# Altium project ECU V1.0 B.PrjPcb (part 12 of 17)
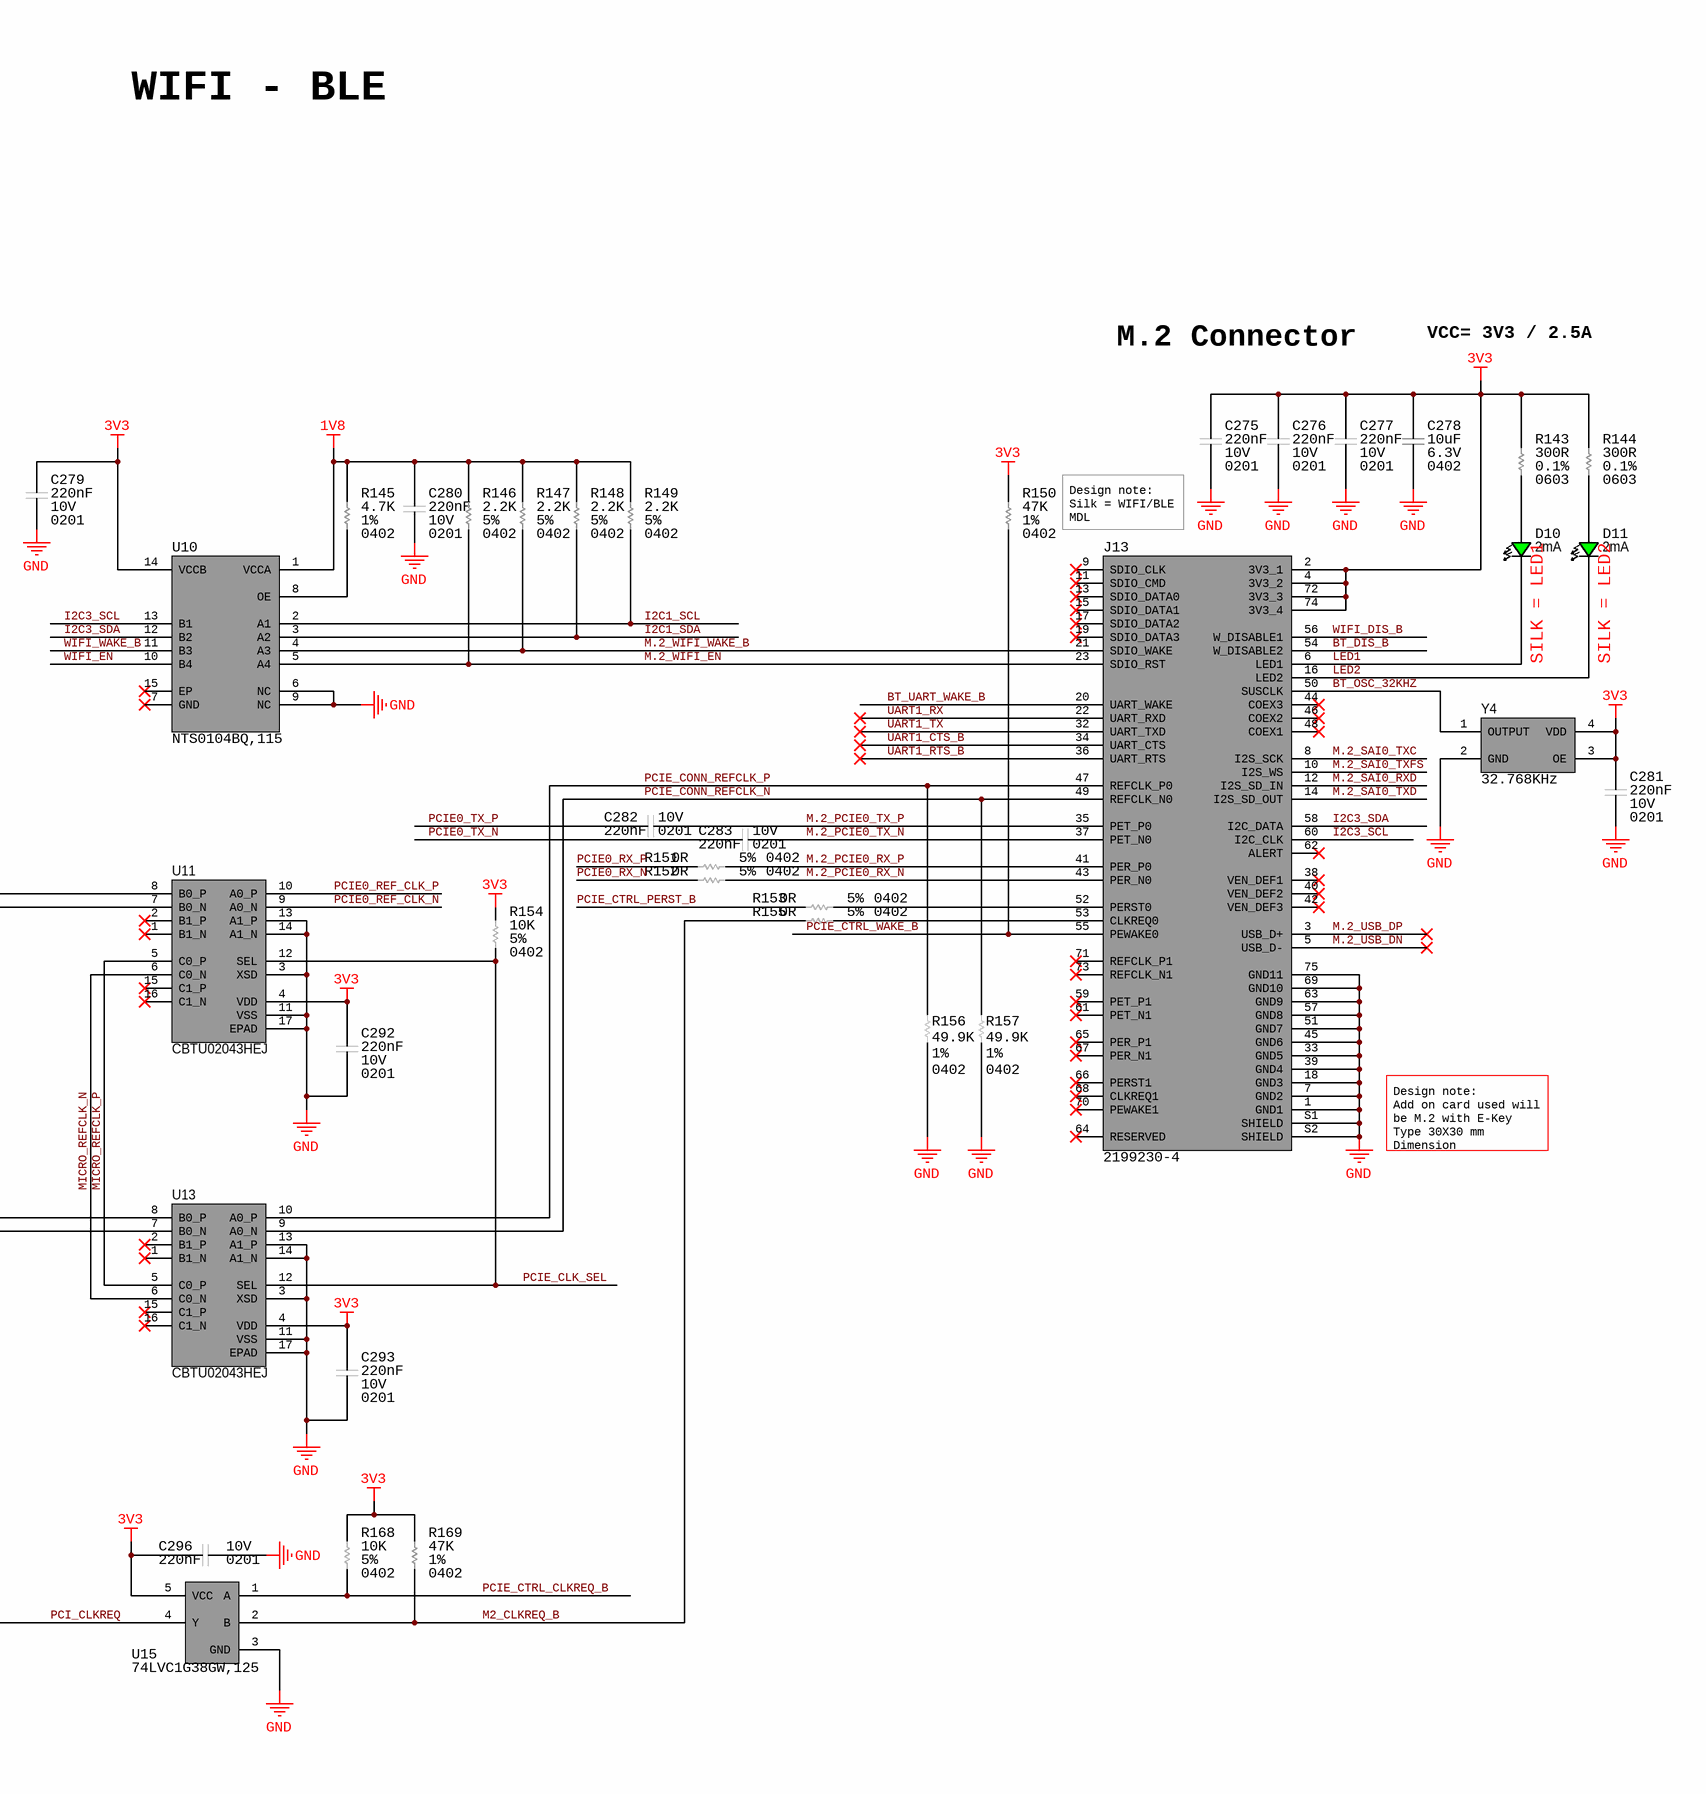
[diagram p20: 19_WIFI_BLE.SchDoc, right]

## Sheet 19_WIFI_BLE.SchDoc (continued)

### Library data of the parts
C275-C277 C279-C283 C292 C293 C296-C299 = CAP_0.22UF_10V_X5R_0201: as C201-C204 on sheet 16_LPDDR; Supplier 1: Digikey; Manufacturer Part Number: LMK063BJ224MP-F; RoHS: Yes; Category: Ceramic Capacitors; Stock 1: 6053224; Pricing 1: 1=0.12, 10=0.08, 50=0.0478, 100=0.0375, 500=0.02772, 1000=0.02295, 2500=0.02136, 5000=0.01954 (USD); Mount: Surface Mount; Case Code (Metric): 0603; Case Code (Imperial): 0201; Min Operating Temperature: -55°C; Max Operating Temperature: 85°C; Voltage Rating: 10V; Packaging: Tape and Reel; Package Quantity: 15000; Dielectric: X5R; Termination: SMD/SMT; Voltage: 10V; Series: M; Construction: Flat; Length: 0.6mm; Width: 0.3mm; Height: 0.3mm; Depth: 0.3mm; Radiation Hardening: No; Halogen Free: Halogen Free; RoHS Compliant: Yes; Reach SVHC Compliant: Unknown; ComponentLink1URL: https://datasheet.ciiva.com/134/lmk063bj224mp-f-ss-134995.pdf?src-supplier=Digikey; ComponentLink1Description: https://datasheet.ciiva.com/134/lmk063bj224mp-f-ss-134995.pdf?src-supplier=Digikey; ComponentLink2URL: https://datasheet.ciiva.com/11464/lmk063bj224mp-f-ss-11464053.pdf?src-supplier=Avnet; ComponentLink2Description: https://datasheet.ciiva.com/11464/lmk063bj224mp-f-ss-11464053.pdf?src-supplier=Avnet; ComponentLink3URL: https://datasheet.ciiva.com/15921/1589lmk063bj224mp-f-15921250.pdf?src-supplier=Onlinecomponents.com; ComponentLink3Description: https://datasheet.ciiva.com/15921/1589lmk063bj224mp-f-15921250.pdf?src-supplier=Onlinecomponents.com; ComponentLink4URL: https://datasheet.ciiva.com/26872/getdatasheetpartid-639019-26872592.pdf?src-supplier=Verical; ComponentLink4Description: https://datasheet.ciiva.com/26872/getdatasheetpartid-639019-26872592.pdf?src-supplier=Verical; ComponentLink5URL: https://datasheet.ciiva.com/30243/100lmk063bj224mp-f-30243150.pdf?src-supplier=Onlinecomponents.com; ComponentLink5Description: https://datasheet.ciiva.com/30243/100lmk063bj224mp-f-30243150.pdf?src-supplier=Onlinecomponents.com; ComponentLink6URL: https://datasheet.ciiva.com/28645/746258-28645141.pdf?src-supplier=Element14; ComponentLink6Description: https://datasheet.ciiva.com/28645/746258-28645141.pdf?src-supplier=Element14; ComponentLink7URL: https://datasheet.ciiva.com/5422/mlcc-all-e-541559-5422365.pdf?src-supplier=Mouser; ComponentLink7Description: https://datasheet.ciiva.com/5422/mlcc-all-e-541559-5422365.pdf?src-supplier=Mouser; Supplier Part Number 1: 587-2483-1-ND
C278 = CAP_10UF_6.3V_X5R_0402: Cap Ceramic 10uF 6.3V X5R 20% SMD 0402 85C T/R; Manufacturer: Samsung; Supplier 1: Digikey; Manufacturer Part Number: CL05A106MQ5NUNC; RoHS: Yes; Category: Ceramic Capacitors; Stock 1: 6097180; Pricing 1: 1=0.24, 10=0.153, 50=0.0968, 100=0.0774, 500=0.05588, 1000=0.04943, 2500=0.04728, 5000=0.04299 (USD); Mount: Surface Mount; Case Code (Metric): 1005; Case Code (Imperial): 0402; Min Operating Temperature: -55°C; Max Operating Temperature: 85°C; Packaging: Tape and Reel; Tolerance: 20%; Dielectric: X5R; Series: CL; Package Quantity: 1; Construction: Flat; Length: 1mm; Width: 0.02inch; Height: 0.5mm; Depth: 0.5mm; Thickness: 0.028inch; Radiation Hardening: No; RoHS Compliant: Yes; ComponentLink1URL: https://datasheet.ciiva.com/16437/cl05a106mq5nunc-16437356.pdf?src-supplier=Future+Electronics; ComponentLink1Description: https://datasheet.ciiva.com/16437/cl05a106mq5nunc-16437356.pdf?src-supplier=Future+Electronics; ComponentLink2URL: https://datasheet.ciiva.com/26877/getdatasheetpartid-355289-26877841.pdf?src-supplier=Verical; ComponentLink2Description: https://datasheet.ciiva.com/26877/getdatasheetpartid-355289-26877841.pdf?src-supplier=Verical; Supplier Part Number 1: 1276-1451-1-ND
C284 C286 C289 = CAP_1UF_6.3V_X5R_0201: 0201 1 uF 6.3 V ±20 % Tolerance X5R Surface Mount Multilayer Ceramic Capacitor; Manufacturer: Kyocera AVX; Tolerance: 20%; Supplier 1: Mouser; Manufacturer Part Number: 02016D105MAT2A; RoHS: Yes; Category: Ceramic Capacitors; Stock 1: 1026413; Pricing 1: 1=0.1, 10=0.028, 50=0.028, 100=0.014, 1000=0.008, 10000=0.006 (USD); Mount: Surface Mount; Number of Pins: 2; Case Code (Metric): 0603; Case Code (Imperial): 0201; Min Operating Temperature: -55°C; Max Operating Temperature: 85°C; Packaging: Cut Tape; Series: -; Voltage Rating: 6.3V; Package Quantity: 1; Length: 0.024inch; Width: 0.012inch; Thickness: 0.013inch; Depth: 0.3mm; Lead Free: Lead Free; RoHS Compliant: Yes; Reach SVHC Compliant: No; ComponentLink1URL: https://datasheet.ciiva.com/6265/cx5r-6265595.pdf?src-supplier=Digi-Key; ComponentLink1Description: https://datasheet.ciiva.com/6265/cx5r-6265595.pdf?src-supplier=Digi-Key; ComponentLink2URL: https://datasheet.ciiva.com/1123/1666675-1123122.pdf?src-supplier=Element14; ComponentLink2Description: https://datasheet.ciiva.com/1123/1666675-1123122.pdf?src-supplier=Element14; ComponentLink3URL: https://datasheet.ciiva.com/14891/cx5r-14891029.pdf?src-supplier=Digi-Key; ComponentLink3Description: https://datasheet.ciiva.com/14891/cx5r-14891029.pdf?src-supplier=Digi-Key; ComponentLink4URL: https://datasheet.ciiva.com/7614/cx5r-7614682.pdf?src-supplier=Digi-Key; ComponentLink4Description: https://datasheet.ciiva.com/7614/cx5r-7614682.pdf?src-supplier=Digi-Key; ComponentLink5URL: https://datasheet.ciiva.com/14891/cx5r-14891030.pdf?src-supplier=Digi-Key; ComponentLink5Description: https://datasheet.ciiva.com/14891/cx5r-14891030.pdf?src-supplier=Digi-Key; Supplier Part Number 1: 581-02016D105MAT2A; Dielectric: X5R
C285 C287 C288 C290 C291 = CAP_100nF_16V_X7S_0201: Multilayer Ceramic Capacitor, 0.1 uF, 16 V, ± 10%, X7S, 0201 [0603 Metric]; Manufacturer: Murata; Material: 4241ConductorMaterial; Supplier 1: Digikey; Manufacturer Part Number: GRM033C71C104KE14D; RoHS: Yes; Category: Ceramic Capacitors; Stock 1: 1786846; Pricing 1: 1=0.1, 10=0.032, 50=0.0186, 100=0.0144, 500=0.01082, 1000=0.0085, 2500=0.00772, 5000=0.00711 (USD); Mount: Surface Mount; Case Code (Metric): 0603; Case Code (Imperial): 0201; Weight: 1.2E-05oz; Min Operating Temperature: -55°C; Max Operating Temperature: 125°C; Packaging: Tape and Reel; Tolerance: 10%; Dielectric: X7S; Termination: SMD/SMT; Voltage Rating (DC): 16V; Package Quantity: 15000; Series: GRM; Length: 0.024inch; Width: 0.012inch; Height: 0.3mm; Thickness: 0.013inch; RoHS Compliant: Yes; ComponentLink1URL: http://www.farnell.com/datasheets/2867828.pdf?src-supplier=Farnell; ComponentLink1Description: http://www.farnell.com/datasheets/2867828.pdf?src-supplier=Farnell; ComponentLink2URL: http://www.mouser.com/ds/2/281/c02e-2905.pdf?src-supplier=Mouser; ComponentLink2Description: http://www.mouser.com/ds/2/281/c02e-2905.pdf?src-supplier=Mouser; ComponentLink3URL: https://search.murata.co.jp/Ceramy/image/img/A01X/G101/ENG/GRM033C71C104KE14-01.pdf?src-supplier=Digikey; ComponentLink3Description: https://search.murata.co.jp/Ceramy/image/img/A01X/G101/ENG/GRM033C71C104KE14-01.pdf?src-supplier=Digikey; ComponentLink4URL: http://www.farnell.com/datasheets/2867828.pdf?src-supplier=Element14; ComponentLink4Description: http://www.farnell.com/datasheets/2867828.pdf?src-supplier=Element14; ComponentLink5URL: https://datasheet.octopart.com/GRM033C71C104KE14D-Murata-datasheet-22122223.pdf?src-supplier=Future+Electronics; ComponentLink5Description: https://datasheet.octopart.com/GRM033C71C104KE14D-Murata-datasheet-22122223.pdf?src-supplier=Future+Electronics; ComponentLink6URL: http://www.farnell.com/datasheets/2867828.pdf?src-supplier=Newark; ComponentLink6Description: http://www.farnell.com/datasheets/2867828.pdf?src-supplier=Newark; Supplier Part Number 1: 490-10387-6-ND
C294 C295 = CAP_6.8pF_50V_NP0_0201: Cap Ceramic 6.8pF 50V C0G 0.1pF Pad SMD 0201 125C T/R; Manufacturer: Murata; Supplier 1: Digikey; Manufacturer Part Number: GRM0335C1H6R8BA01D; RoHS: Yes; Category: Ceramic Capacitors; Stock 1: 177494; Pricing 1: 1=0.1, 10=0.018, 100=0.0098, 1000=0.00587, 2500=0.00466, 5000=0.0039 (USD); Mount: Surface Mount; Case Code (Imperial): 0201; Case Code (Metric): 0603; Min Operating Temperature: -55°C; Max Operating Temperature: 125°C; Voltage Rating (DC): 50V; Packaging: Tape and Reel; Package Quantity: 15000; Dielectric: C0G; Termination: SMD/SMT; Series: GRM; Length: 0.024inch; Width: 0.3mm; Height: 0.3mm; Thickness: 0.013inch; RoHS Compliant: Yes; ComponentLink1URL: https://datasheet.ciiva.com/29538/partnumbering-e-01-29538455.pdf?src-supplier=Digikey; ComponentLink1Description: https://datasheet.ciiva.com/29538/partnumbering-e-01-29538455.pdf?src-supplier=Digikey; Supplier Part Number 1: 490-17817-1-ND
D10 D11 = LED_DIO_GREEN_2mA_APDA3020LZGCK: LED GREEN CLEAR 2SMD R/A  1500mcd; Manufacturer: Kingbright; Lens Color: Colorless; Luminous Intensity: 600mcd; Viewing Angle: 10°; Dominant Wavelength: 525nm; Forward Voltage: 2.65V; Lens Style: Round,Domed; Lens Size: 1.9mm; Supplier 1: Digikey; Manufacturer Part Number: APDA3020LZGCK; RoHS: Yes; Category: LEDs; Stock 1: 19931; Pricing 1: 1=0.55, 10=0.364, 100=0.241, 1000=0.1861, 2000=0.16817, 6000=0.15695, 10000=0.15135, 50000=0.14294 (USD); Mount: Surface Mount; Case/Package: SMD/SMT; Color: Green; Packaging: Cut Tape; Lens Transparency: Clear; Series: -; Length: 3mm; Width: 2.8mm; Height: 2mm; RoHS Compliant: Yes; ComponentLink1URL: http://www.mouser.com/ds/2/216/APDA3020LZGCK-535649.pdf?src-supplier=Mouser; ComponentLink1Description: http://www.mouser.com/ds/2/216/APDA3020LZGCK-535649.pdf?src-supplier=Mouser; ComponentLink2URL: http://www.kingbrightusa.com/images/catalog/SPEC/APDA3020LZGCK.pdf?src-supplier=Digikey; ComponentLink2Description: http://www.kingbrightusa.com/images/catalog/SPEC/APDA3020LZGCK.pdf?src-supplier=Digikey; Supplier Part Number 1: 754-1929-1-ND
FB4 FB5 = IND_FERRITE_BEADS_600R_300mA_0603_742792653: Chip NTC Thermistors (Sensor), Resistance (at 25°C)=10kΩ, Resistance Tolerance (at 25°C)=±1%; Manufacturer: Wurth Electronics; Tolerance: 25%; Max Current Rating: 300mA; Number of Lines: 1; Inductance: 2.4nH; Test Frequency: 200MHz; Resistance Tolerance: 1%; Max Power Dissipation: 100mW; Supplier 1: Digikey; Manufacturer Part Number: 742792653; RoHS: Yes; Category: Ferrite Beads and Chips; Stock 1: 14278; Pricing 1: 1=0.16, 50=0.1612, 100=0.1485, 500=0.1422, 1000=0.135, 2000=0.1287 (USD); Mount: Surface Mount; Case/Package: SMD/SMT; Core Material: Ferrite; Case Code (Metric): 1608; Weight: 7.1E-05oz; Material: Ferrite; Min Operating Temperature: -55°C; Max Operating Temperature: 125°C; Packaging: Tape and Reel; Package Quantity: 1; Max DC Current: 300mA; Termination: SMD/SMT; Series: WE-CBF; Length: 1.6mm; Width: 0.8mm; Height: 0.8mm; Depth: 0.8mm; Lead Free: Lead Free; RoHS Compliant: Yes; Reach SVHC Compliant: Unknown; ComponentLink1URL: https://datasheet.ciiva.com/29364/742792653-29364337.pdf?src-supplier=Digikey; ComponentLink1Description: https://datasheet.ciiva.com/29364/742792653-29364337.pdf?src-supplier=Digikey; ComponentLink2URL: https://datasheet.ciiva.com/1475/1696030-1475350.pdf?src-supplier=Farnell; ComponentLink2Description: https://datasheet.ciiva.com/1475/1696030-1475350.pdf?src-supplier=Farnell; ComponentLink3URL: https://datasheet.ciiva.com/11799/0900766b80d2e07a-11799236.pdf?src-supplier=Rs; ComponentLink3Description: https://datasheet.ciiva.com/11799/0900766b80d2e07a-11799236.pdf?src-supplier=Rs; ComponentLink4URL: https://datasheet.ciiva.com/1466/1696030-1466507.pdf?src-supplier=Element14; ComponentLink4Description: https://datasheet.ciiva.com/1466/1696030-1466507.pdf?src-supplier=Element14; ComponentLink5URL: https://datasheet.ciiva.com/14122/742792653-eng-tds-14122813.pdf?src-supplier=Distrelec; ComponentLink5Description: https://datasheet.ciiva.com/14122/742792653-eng-tds-14122813.pdf?src-supplier=Distrelec; Supplier Part Number 1: 732-4668-1-ND; Current Rating: 300mA; Supplier 2: Digikey; Stock 2: 379736; Pricing 2: 1=0.1, 5=0.072, 10=0.068, 25=0.0624, 50=0.0588, 100=0.0555, 500=0.04876, 1000=0.04627, 5000=0.0413 (USD); Accuracy: 1%; Radiation Hardening: No; ComponentLink6URL: https://datasheet.ciiva.com/2848/ntcg103jf103ft1-web-2848583.pdf?src-supplier=Digikey; ComponentLink6Description: https://datasheet.ciiva.com/2848/ntcg103jf103ft1-web-2848583.pdf?src-supplier=Digikey; ComponentLink7URL: https://datasheet.ciiva.com/2848/ntcg103jf103ft1-web-2848584.pdf?src-supplier=Digikey; ComponentLink7Description: https://datasheet.ciiva.com/2848/ntcg103jf103ft1-web-2848584.pdf?src-supplier=Digikey; ComponentLink8URL: https://datasheet.ciiva.com/2848/ntcg103jf103ft1-web-2848585.pdf?src-supplier=Digikey; ComponentLink8Description: https://datasheet.ciiva.com/2848/ntcg103jf103ft1-web-2848585.pdf?src-supplier=Digikey; Supplier Part Number 2: 445-2550-1-ND
J13 = CONN_M.2_FEMALE_2199230-4: CONNECTOR, BACKPLANE, HOUSING, RCPT, 67POS, 2ROW; Connector Type: Card Edge; Seri; Manufacturer: TE Connectivity; Plating: 157ConductorMaterial; Current Rating: 500mA; Operating Supply Voltage: 50V; Gender: Female; Number of Positions: 67; Insulation Resistance: 500MR; PCB Mounting Orientation: Right Angle; Sealable: 5964ProductFeature; Circuit Application: 313ConnectorType; Pitch: 0.5mm; Row Spacing: 7.55mm; Supplier 1: Digikey; Manufacturer Part Number: 2199230-4; RoHS: Yes; Category: Card Edge Connectors; Stock 1: 9378; Pricing 1: 1=1.79, 10=1.524, 25=1.4284, 50=1.36, 100=1.2951, 250=1.21392, 500=1.15596 (USD); Mount: Surface Mount; Color: Black; Contact Material: Copper Alloy; Contact Plating: Gold,Matte; Housing Color: Black; Insulation Material: Thermoplastic; Housing Material: Thermoplastic; Min Operating Temperature: -40°C; Max Operating Temperature: 80°C; Packaging: Tape and Reel; Termination: Solder; Series: -; Package Quantity: 1000; Number of Rows: 2; Voltage Rating: 50V; Number of Contacts: 67; Contact Current Rating: 500mA; Contact Type: -; Orientation: 5492OrientationType; Length: 0.862inch; Width: 8.7mm; Height: 0.165inch; RoHS Compliant: Yes; ELV: 5681ELVCompliant; Reach SVHC Compliant: Unknown; ComponentLink1URL: https://datasheet.ciiva.com/18495/eng-cd-2199230-b1-c-2199230-b1-18495978.pdf?src-supplier=Digikey; ComponentLink1Description: https://datasheet.ciiva.com/18495/eng-cd-2199230-b1-c-2199230-b1-18495978.pdf?src-supplier=Digikey; ComponentLink2URL: https://datasheet.ciiva.com/18495/eng-cd-2199230-b1-c-2199230-b1-18495979.pdf?src-supplier=Digikey; ComponentLink2Description: https://datasheet.ciiva.com/18495/eng-cd-2199230-b1-c-2199230-b1-18495979.pdf?src-supplier=Digikey; ComponentLink3URL: https://datasheet.ciiva.com/18495/eng-cd-2199230-b1-c-2199230-b1-18495980.pdf?src-supplier=Digikey; ComponentLink3Description: https://datasheet.ciiva.com/18495/eng-cd-2199230-b1-c-2199230-b1-18495980.pdf?src-supplier=Digikey; ComponentLink4URL: https://datasheet.ciiva.com/22714/1918022-22714780.pdf?src-supplier=Element14; ComponentLink4Description: https://datasheet.ciiva.com/22714/1918022-22714780.pdf?src-supplier=Element14; ComponentLink5URL: https://datasheet.ciiva.com/28797/1918022-28797822.pdf?src-supplier=Element14; ComponentLink5Description: https://datasheet.ciiva.com/28797/1918022-28797822.pdf?src-supplier=Element14; ComponentLink6URL: https://datasheet.ciiva.com/28797/1918022-28797830.pdf?src-supplier=Element14; ComponentLink6Description: https://datasheet.ciiva.com/28797/1918022-28797830.pdf?src-supplier=Element14; Supplier Part Number 1: A115904CT-ND
R136-R142 R151-R153 R155 R158-R165 R167 R170 = RES_0R_5%_100mW_0402: SMD Chip Resistor, Jumper, 0 ohm, 100 mW, 0402 [1005 Metric], Thick Film, General Purpose; Manufacturer: Panasonic; Power Rating: 100mW; Voltage Rating: 50V; Temperature Coefficient: 600ppm/°C; Supplier 1: Mouser; Manufacturer Part Number: ERJ-2GE0R00X; RoHS: Yes; Category: Chip SMD Resistors; Stock 1: 10989354; Pricing 1: 1=0.1, 10=0.013, 50=0.013, 100=0.006, 1000=0.004, 2500=0.003, 10000=0.003 (USD); Mount: Surface Mount; Case/Package: 0402; Contact Plating: Tin; Case Code (Metric): 1005; Size Code: 0402; Min Operating Temperature: -55°C; Max Operating Temperature: 155°C; Resistor Type: Thick Film; Packaging: Cut Tape; Package Quantity: 10000; Number of Terminations: 2; Termination: SMD/SMT; Max Power Dissipation: 100mW; Voltage Rating (DC): 50V; Features: Automotive AEC-Q200; Series: ERJ; Construction: Rectangular; Technology: THICK FILM; Length: 1mm; Width: 0.5mm; Height: 0.35mm; Depth: 0.5mm; Ratings: AEC-Q200; Radiation Hardening: No; Reach SVHC Compliant: No; Military Standard: Not; Lead Free: Lead Free; RoHS Compliant: Yes; ComponentLink1URL: https://datasheet.ciiva.com/11821/0900766b80f806dd-11821176.pdf?src-supplier=Rs; ComponentLink1Description: https://datasheet.ciiva.com/11821/0900766b80f806dd-11821176.pdf?src-supplier=Rs; ComponentLink2URL: https://datasheet.ciiva.com/43460/1678796-43460347.pdf?src-supplier=Farnell; ComponentLink2Description: https://datasheet.ciiva.com/43460/1678796-43460347.pdf?src-supplier=Farnell; ComponentLink3URL: https://datasheet.ciiva.com/46389/1678796-46389518.pdf?src-supplier=Element14; ComponentLink3Description: https://datasheet.ciiva.com/46389/1678796-46389518.pdf?src-supplier=Element14; ComponentLink4URL: https://datasheet.ciiva.com/5959/1678796-5959692.pdf?src-supplier=Farnell; ComponentLink4Description: https://datasheet.ciiva.com/5959/1678796-5959692.pdf?src-supplier=Farnell; ComponentLink5URL: https://datasheet.ciiva.com/28695/1678796-28695758.pdf?src-supplier=Element14; ComponentLink5Description: https://datasheet.ciiva.com/28695/1678796-28695758.pdf?src-supplier=Element14; ComponentLink6URL: https://datasheet.ciiva.com/16783/70260739-16783734.pdf?src-supplier=Allied+Electronics; ComponentLink6Description: https://datasheet.ciiva.com/16783/70260739-16783734.pdf?src-supplier=Allied+Electronics; ComponentLink7URL: https://datasheet.ciiva.com/16778/70260739-16778335.pdf?src-supplier=Allied+Electronics; ComponentLink7Description: https://datasheet.ciiva.com/16778/70260739-16778335.pdf?src-supplier=Allied+Electronics; ComponentLink8URL: https://datasheet.ciiva.com/48531/aoa0000ce1-48531077.pdf?src-supplier=Avnet; ComponentLink8Description: https://datasheet.ciiva.com/48531/aoa0000ce1-48531077.pdf?src-supplier=Avnet; ComponentLink9URL: https://datasheet.ciiva.com/30097/4aoa0000ce1-30097116.pdf?src-supplier=Onlinecomponents.com; ComponentLink9Description: https://datasheet.ciiva.com/30097/4aoa0000ce1-30097116.pdf?src-supplier=Onlinecomponents.com; Supplier Part Number 1: 667-ERJ-2GE0R00X
R143 R144 = RES_300R_0.1%_100mW_0603: Res Thin Film 0603 300 Ohm 0.1% 0.1W(1/10W) ±25ppm/C Pad SMD T/R; Manufacturer: Yageo; Power Rating: 100mW; Voltage Rating: 75V; Temperature Coefficient: 25ppm/°C; Voltage Rating (DC): 50V; Supplier 1: Digikey; Manufacturer Part Number: RT0603BRD07300RL; RoHS: Yes; Category: Chip SMD Resistors; Stock 1: 20376; Pricing 1: 1=0.13, 10=0.1, 50=0.0764, 100=0.0724, 500=0.05406, 1000=0.04692 (USD); Case/Package: 0603; Case Code (Metric): 1608; Contact Plating: Tin,Matte; Min Operating Temperature: -55°C; Max Operating Temperature: 125°C; Package Quantity: 5000; Packaging: Tape and Reel; Number of Terminations: 2; Termination: SMD/SMT; Max Power Dissipation: 100mW; Features: Moisture Resistant; Series: RT; Length: 0.063inch; Width: 0.031inch; Height: 0.022inch; Lead Free: Lead Free; RoHS Compliant: Yes; ComponentLink1URL: https://datasheet.ciiva.com/2585/pyu-rt-1-to-0-05-rohs-l-4-2585867.pdf?src-supplier=Digikey; ComponentLink1Description: https://datasheet.ciiva.com/2585/pyu-rt-1-to-0-05-rohs-l-4-2585867.pdf?src-supplier=Digikey; Supplier Part Number 1: YAG1628CT-ND
R145 = RES_4.7K_1%_100mW_0402: Res Thick Film 0402 4.7K Ohm 1% 0.1W ±100ppm/°C Molded SMD Punched Carrier T/R; Manufacturer: Panasonic; Power Rating: 100mW; Voltage Rating: 50V; Supplier 1: Digi-Key; Manufacturer Part Number: ERJ-2RKF4701X; RoHS: Yes; Category: Chip SMD Resistors; Stock 1: 2269675; Pricing 1: 1=0.1, 10=0.024, 50=0.015, 100=0.0125, 500=0.00848, 1000=0.00731, 5000=0.00531 (USD); Case Code (Metric): 1005; Weight: 0.000388oz; Min Operating Temperature: -55°C; Max Operating Temperature: 155°C; Temperature Coefficient: 100ppm/°C; Packaging: Cut Tape; Package Quantity: 10000; Termination: SMD/SMT; Voltage Rating (DC): 50V; Series: ERJ-2Rx; Technology: THICK FILM; Length: 1mm; Width: 0.5mm; Height: 0.35mm; Lead Free: Lead Free; RoHS Compliant: Yes; ComponentLink1URL: https://datasheet.ciiva.com/30053/aoa0000ce2-30053990.pdf?src-supplier=Onlinecomponents.com; ComponentLink1Description: https://datasheet.ciiva.com/30053/aoa0000ce2-30053990.pdf?src-supplier=Onlinecomponents.com; ComponentLink2URL: https://datasheet.ciiva.com/7830/aoa0000ce2-7830727.pdf?src-supplier=Element14; ComponentLink2Description: https://datasheet.ciiva.com/7830/aoa0000ce2-7830727.pdf?src-supplier=Element14; ComponentLink3URL: https://datasheet.ciiva.com/22781/1678782-22781576.pdf?src-supplier=Farnell; ComponentLink3Description: https://datasheet.ciiva.com/22781/1678782-22781576.pdf?src-supplier=Farnell; ComponentLink4URL: https://datasheet.ciiva.com/22667/1678782-22667886.pdf?src-supplier=Element14; ComponentLink4Description: https://datasheet.ciiva.com/22667/1678782-22667886.pdf?src-supplier=Element14; ComponentLink5URL: https://datasheet.ciiva.com/22723/1678782-22723903.pdf?src-supplier=Element14; ComponentLink5Description: https://datasheet.ciiva.com/22723/1678782-22723903.pdf?src-supplier=Element14; Supplier Part Number 1: P4.70KLCT-ND
R146-R149 = RES_2.2K_5%_63mW_0402: SMD Chip Resistor, 2.2 kOhm, ± 5%, 63 mW, 0402 [1005 Metric], Thick Film, General Purpose; Manufacturer: Yageo; Power Rating: 62.5mW; Voltage Rating: 50V; Temperature Coefficient: 100ppm/°C; Max Power Dissipation: 63mW; Supplier 1: Mouser; Manufacturer Part Number: RC0402JR-072K2L; RoHS: Yes; Category: Chip SMD Resistors; Stock 1: 27488; Pricing 1: 1=0.1, 10=0.011, 50=0.011, 100=0.006, 1000=0.005, 10000=0.002 (USD); Case Code (Metric): 1005; Case Code (Imperial): 0402; Weight: 2.3E-05oz; Min Operating Temperature: -55°C; Max Operating Temperature: 155°C; Package Quantity: 1; Packaging: Tape and Reel; Resistor Type: Thick Film; Number of Terminations: 2; Termination: SMD/SMT; Working Voltage: 50V; Features: Moisture Resistant; Series: RC; Resistance Tolerance: 5%; Construction: Rectangular; Technology: THICK FILM; Voltage Rating (AC): 50V; Length: 1mm; Width: 0.02inch; Height: 0.016inch; Depth: 0.5mm; Reach SVHC Compliant: No; Military Standard: Not; RoHS Compliant: Yes; Lead Free: 5697LeadFree; ComponentLink1URL: https://datasheet.ciiva.com/2518/pyu-r-int-thick-7-2518881.pdf?src-supplier=Digikey; ComponentLink1Description: https://datasheet.ciiva.com/2518/pyu-r-int-thick-7-2518881.pdf?src-supplier=Digikey; ComponentLink2URL: https://datasheet.ciiva.com/2518/pyu-r-int-thick-7-2518882.pdf?src-supplier=Digikey; ComponentLink2Description: https://datasheet.ciiva.com/2518/pyu-r-int-thick-7-2518882.pdf?src-supplier=Digikey; ComponentLink3URL: https://datasheet.ciiva.com/2518/pyu-r-int-thick-7-2518880.pdf?src-supplier=Digikey; ComponentLink3Description: https://datasheet.ciiva.com/2518/pyu-r-int-thick-7-2518880.pdf?src-supplier=Digikey; ComponentLink4URL: https://datasheet.ciiva.com/12577/pyu-rc0402-51-rohs-l-6-r-12577433.pdf?src-supplier=Mouser; ComponentLink4Description: https://datasheet.ciiva.com/12577/pyu-rc0402-51-rohs-l-6-r-12577433.pdf?src-supplier=Mouser; ComponentLink5URL: https://datasheet.ciiva.com/7850/1018594-7850191.pdf?src-supplier=Element14; ComponentLink5Description: https://datasheet.ciiva.com/7850/1018594-7850191.pdf?src-supplier=Element14; ComponentLink6URL: https://datasheet.ciiva.com/7850/1018594-7850190.pdf?src-supplier=Element14; ComponentLink6Description: https://datasheet.ciiva.com/7850/1018594-7850190.pdf?src-supplier=Element14; ComponentLink7URL: https://datasheet.ciiva.com/16741/pyu-rc0402-51-rohs-l-6-r-16741086.pdf?src-supplier=Future+Electronics; ComponentLink7Description: https://datasheet.ciiva.com/16741/pyu-rc0402-51-rohs-l-6-r-16741086.pdf?src-supplier=Future+Electronics; ComponentLink8URL: https://datasheet.ciiva.com/15189/getdatasheetpartid-327800-15189558.pdf?src-supplier=Verical; ComponentLink8Description: https://datasheet.ciiva.com/15189/getdatasheetpartid-327800-15189558.pdf?src-supplier=Verical; Supplier Part Number 1: 603-RC0402JR-072K2L
R150 R169 = RES_47K_1%_100MW_0402: Res Thick Film 0402 47K Ohm 1% 0.1W ±100ppm/°C Molded SMD Punched Carrier T/R; Manufacturer: Panasonic; Voltage Rating: 50V; Power Rating: 100mW; Supplier 1: Digikey; Manufacturer Part Number: ERJ-2RKF4702X; RoHS: Yes; Category: Chip SMD Resistors; Stock 1: 2389237; Pricing 1: 1=0.1, 10=0.024, 50=0.0152, 100=0.0127, 500=0.00866, 1000=0.00746, 5000=0.00542 (USD); Mount: Surface Mount; Number of Pins: 2; Contact Plating: Tin; Case Code (Imperial): 0402; Case Code (Metric): 1005; Min Operating Temperature: -55°C; Max Operating Temperature: 155°C; Resistor Type: Thick Film; Temperature Coefficient: 100ppm/°C; Packaging: Tape and Reel; Package Quantity: 1; Termination: SMD/SMT; Number of Terminations: 2; Max Power Dissipation: 100mW; Features: Automotive AEC-Q200; Series: ERJ; Resistance Tolerance: 1%; Technology: THICK FILM; Construction: Rectangular; Voltage Rating (DC): 50V; Length: 1mm; Width: 0.5mm; Height: 0.35mm; Depth: 0.5mm; Radiation Hardening: No; Reach SVHC Compliant: No; Military Standard: Not; RoHS Compliant: Yes; Lead Free: 5697LeadFree; ComponentLink1URL: https://datasheet.ciiva.com/11821/0900766b80f80784-11821335.pdf?src-supplier=Rs; ComponentLink1Description: https://datasheet.ciiva.com/11821/0900766b80f80784-11821335.pdf?src-supplier=Rs; ComponentLink2URL: https://datasheet.ciiva.com/7802/aoa0000ce2-7802411.pdf?src-supplier=Element14; ComponentLink2Description: https://datasheet.ciiva.com/7802/aoa0000ce2-7802411.pdf?src-supplier=Element14; ComponentLink3URL: https://datasheet.ciiva.com/7802/426256-7802678.pdf?src-supplier=Element14; ComponentLink3Description: https://datasheet.ciiva.com/7802/426256-7802678.pdf?src-supplier=Element14; ComponentLink4URL: https://datasheet.ciiva.com/43467/1678782-43467455.pdf?src-supplier=Farnell; ComponentLink4Description: https://datasheet.ciiva.com/43467/1678782-43467455.pdf?src-supplier=Farnell; ComponentLink5URL: https://datasheet.ciiva.com/46372/1678782-46372853.pdf?src-supplier=Element14; ComponentLink5Description: https://datasheet.ciiva.com/46372/1678782-46372853.pdf?src-supplier=Element14; ComponentLink6URL: https://datasheet.ciiva.com/22668/1678782-22668316.pdf?src-supplier=Element14; ComponentLink6Description: https://datasheet.ciiva.com/22668/1678782-22668316.pdf?src-supplier=Element14; ComponentLink7URL: https://datasheet.ciiva.com/28587/1678782-28587161.pdf?src-supplier=Element14; ComponentLink7Description: https://datasheet.ciiva.com/28587/1678782-28587161.pdf?src-supplier=Element14; ComponentLink8URL: https://datasheet.ciiva.com/16769/70260748-16769387.pdf?src-supplier=Allied+Electronics; ComponentLink8Description: https://datasheet.ciiva.com/16769/70260748-16769387.pdf?src-supplier=Allied+Electronics; ComponentLink9URL: https://datasheet.ciiva.com/16770/70260748-16770349.pdf?src-supplier=Allied+Electronics; ComponentLink9Description: https://datasheet.ciiva.com/16770/70260748-16770349.pdf?src-supplier=Allied+Electronics; ComponentLink10URL: https://datasheet.ciiva.com/9189/aoa0000ce2-9189321.pdf?src-supplier=Avnet; ComponentLink10Description: https://datasheet.ciiva.com/9189/aoa0000ce2-9189321.pdf?src-supplier=Avnet; Supplier Part Number 1: P47.0KLDKR-ND
R154 R166 R168 = RES_10K_5%_100mW_0402: Res Thick Film 0402 10K Ohm 5% 1/10W ±200ppm/°C Molded SMD Punched Carrier T/R; Manufacturer: Panasonic; Power Rating: 100mW; Voltage Rating: 50V; Supplier 1: Digi-Key; Manufacturer Part Number: ERJ-2GEJ103X; RoHS: Yes; Category: Chip SMD Resistors; Stock 1: 4696986; Pricing 1: 1=0.1, 10=0.021, 50=0.0132, 100=0.011, 500=0.00744, 1000=0.00639, 5000=0.00464 (USD); Mount: Surface Mount; Contact Plating: Tin; Case Code (Metric): 1005; Case Code (Imperial): 0402; Size Code: 0402; Min Operating Temperature: -55°C; Max Operating Temperature: 155°C; Temperature Coefficient: 200ppm/°C; Packaging: Cut Tape; Resistor Type: Thick Film; Package Quantity: 10000; Number of Terminations: 2; Termination: SMD/SMT; Max Power Dissipation: 100mW; Features: Automotive AEC-Q200; Series: ERJ; Resistance Tolerance: 5%; Technology: THICK FILM; Voltage Rating (DC): 50V; Length: 1mm; Width: 0.5mm; Height: 0.35mm; Depth: 0.5mm; Ratings: AEC-Q200; Radiation Hardening: No; Reach SVHC Compliant: No; RoHS Compliant: Yes; Lead Free: 5697LeadFree; ComponentLink1URL: https://datasheet.ciiva.com/27055/1935721-27055112.pdf?src-supplier=Jameco; ComponentLink1Description: https://datasheet.ciiva.com/27055/1935721-27055112.pdf?src-supplier=Jameco; ComponentLink2URL: https://datasheet.ciiva.com/11821/0900766b80f806dd-11821170.pdf?src-supplier=Rs; ComponentLink2Description: https://datasheet.ciiva.com/11821/0900766b80f806dd-11821170.pdf?src-supplier=Rs; ComponentLink3URL: https://datasheet.ciiva.com/43460/1678796-43460391.pdf?src-supplier=Farnell; ComponentLink3Description: https://datasheet.ciiva.com/43460/1678796-43460391.pdf?src-supplier=Farnell; ComponentLink4URL: https://datasheet.ciiva.com/22785/1678796-22785949.pdf?src-supplier=Farnell; ComponentLink4Description: https://datasheet.ciiva.com/22785/1678796-22785949.pdf?src-supplier=Farnell; ComponentLink5URL: https://datasheet.ciiva.com/46371/1678796-46371910.pdf?src-supplier=Element14; ComponentLink5Description: https://datasheet.ciiva.com/46371/1678796-46371910.pdf?src-supplier=Element14; ComponentLink6URL: https://datasheet.ciiva.com/28514/1678796-28514154.pdf?src-supplier=Element14; ComponentLink6Description: https://datasheet.ciiva.com/28514/1678796-28514154.pdf?src-supplier=Element14; ComponentLink7URL: https://datasheet.ciiva.com/24070/aoa0000ce1-37422-24070679.pdf?src-supplier=Mouser; ComponentLink7Description: https://datasheet.ciiva.com/24070/aoa0000ce1-37422-24070679.pdf?src-supplier=Mouser; ComponentLink8URL: https://datasheet.ciiva.com/16767/70260739-16767130.pdf?src-supplier=Allied+Electronics; ComponentLink8Description: https://datasheet.ciiva.com/16767/70260739-16767130.pdf?src-supplier=Allied+Electronics; ComponentLink9URL: https://datasheet.ciiva.com/16774/70260739-16774504.pdf?src-supplier=Allied+Electronics; ComponentLink9Description: https://datasheet.ciiva.com/16774/70260739-16774504.pdf?src-supplier=Allied+Electronics; ComponentLink10URL: https://datasheet.ciiva.com/9194/aoa0000ce1-9194140.pdf?src-supplier=Avnet; ComponentLink10Description: https://datasheet.ciiva.com/9194/aoa0000ce1-9194140.pdf?src-supplier=Avnet; Supplier Part Number 1: P10KJCT-ND
R156 R157 = RES_49.9K_1%_0.0625W_0402: Res Thick Film 0402 49.9K Ohm 1% 1/16W ±100ppm/°C Molded SMD SMD Paper T/R; Manufacturer: Vishay; Power Rating: 63mW; Voltage Rating: 50V; Supplier 1: Mouser; Manufacturer Part Number: CRCW040249K9FKED; RoHS: Yes; Category: Chip SMD Resistors; Stock 1: 180803; Pricing 1: 1=0.1, 10=0.017, 50=0.017, 100=0.014, 1000=0.008, 10000=0.004 (USD); Case Code (Imperial): 0402; Case Code (Metric): 1005; Weight: 2.3E-05oz; Contact Plating: Tin; Size Code: 0402; Min Operating Temperature: -55°C; Max Operating Temperature: 155°C; Packaging: Tape and Reel; Number of Terminations: 2; Temperature Coefficient: 100ppm/°C; Max Power Dissipation: 63mW; Series: CRCW; Package Quantity: 10; Termination: SMD/SMT; Voltage Rating (DC): 50V; Features: Automotive AEC-Q200; Resistor Type: Thick Film; Resistance Tolerance: 1%; Construction: Rectangular; Technology: THICK FILM; Length: 1mm; Width: 0.02inch; Height: 0.35mm; Depth: 0.5mm; Radiation Hardening: No; RoHS Compliant: Yes; Lead Free: 5697LeadFree; Military Standard: Not; Reach SVHC Compliant: Unknown; ComponentLink1URL: https://datasheet.ciiva.com/11811/0900766b80d98824-11811447.pdf?src-supplier=Rs; ComponentLink1Description: https://datasheet.ciiva.com/11811/0900766b80d98824-11811447.pdf?src-supplier=Rs; ComponentLink2URL: https://datasheet.ciiva.com/2463/dcrcwe3-2463274.pdf?src-supplier=Digikey; ComponentLink2Description: https://datasheet.ciiva.com/2463/dcrcwe3-2463274.pdf?src-supplier=Digikey; ComponentLink3URL: https://datasheet.ciiva.com/2463/dcrcwe3-2463275.pdf?src-supplier=Digikey; ComponentLink3Description: https://datasheet.ciiva.com/2463/dcrcwe3-2463275.pdf?src-supplier=Digikey; ComponentLink4URL: https://datasheet.ciiva.com/2463/dcrcwe3-2463276.pdf?src-supplier=Digikey; ComponentLink4Description: https://datasheet.ciiva.com/2463/dcrcwe3-2463276.pdf?src-supplier=Digikey; ComponentLink5URL: https://datasheet.ciiva.com/22702/1697337-22702812.pdf?src-supplier=Element14; ComponentLink5Description: https://datasheet.ciiva.com/22702/1697337-22702812.pdf?src-supplier=Element14; ComponentLink6URL: https://datasheet.ciiva.com/16770/70201119-16770108.pdf?src-supplier=Allied+Electronics; ComponentLink6Description: https://datasheet.ciiva.com/16770/70201119-16770108.pdf?src-supplier=Allied+Electronics; Supplier Part Number 1: 71-CRCW0402-49.9K-E3
TP45 TP46 = TP_PAD_SMD_SMALL: Test Point, SMD pad, round, 1.5mm, 1.6mm, 3mm diameter
U10 = IC_LEVEL_TRASLATE_4CH_NTS0104BQ,115: Voltage Level Translator Bidirectional 1 Circuit 4 Channel 50Mbps 14-DHVQFN (2.5x3); Manufacturer: NXP Semiconductors; Number of Channels: 4; Min Supply Voltage: 1.65V; Max Supply Voltage: 5.5V; Propagation Delay: 280ns; Max Power Dissipation: 250mW; Turn-On Delay Time: 5.8ns; Low Level Output Current: 1mA; High Level Output Current: -20uA; Quiescent Current: 45uA; Number of Elements: 1; Polarity: Non-Inverting; Operating Frequency-Max: 10MHz; Supplier 1: Digikey; Manufacturer Part Number: NTS0104BQ,115; RoHS: Yes; Category: Voltage Level Shifters; Stock 1: 34508; Pricing 1: 1=0.91, 10=0.655, 25=0.5904, 100=0.5192, 250=0.48524, 500=0.46478, 1000=0.46359 (USD); Mount: Surface Mount; Number of Pins: 14; Min Operating Temperature: -40°C; Max Operating Temperature: 125°C; Data Rate: 50Mbps; Packaging: Tape and Reel; Package Quantity: 1; Logic Function: Translator; Number of Bits: 4; Output Type: Voltage; Series: -; Radiation Hardening: No; Reach SVHC Compliant: No; Lead Free: Lead Free; RoHS Compliant: Yes; ComponentLink1URL: https://datasheet.ciiva.com/15096/getdatasheetpartid-509197-15096330.pdf?src-supplier=Verical; ComponentLink1Description: https://datasheet.ciiva.com/15096/getdatasheetpartid-509197-15096330.pdf?src-supplier=Verical; ComponentLink2URL: https://datasheet.ciiva.com/1899/nts0104-1899077.pdf?src-supplier=Digikey; ComponentLink2Description: https://datasheet.ciiva.com/1899/nts0104-1899077.pdf?src-supplier=Digikey; ComponentLink3URL: https://datasheet.ciiva.com/1899/nts0104-1899078.pdf?src-supplier=Digikey; ComponentLink3Description: https://datasheet.ciiva.com/1899/nts0104-1899078.pdf?src-supplier=Digikey; ComponentLink4URL: https://datasheet.ciiva.com/1899/nts0104-1899079.pdf?src-supplier=Digikey; ComponentLink4Description: https://datasheet.ciiva.com/1899/nts0104-1899079.pdf?src-supplier=Digikey; ComponentLink5URL: https://datasheet.ciiva.com/8244/nts0104-8244157.pdf?src-supplier=Avnet; ComponentLink5Description: https://datasheet.ciiva.com/8244/nts0104-8244157.pdf?src-supplier=Avnet; Supplier Part Number 1: 568-8407-1-ND
U11 U13 = IC_SWITCH_TYPEC_CBTU02043HEJ: USB 3.1 Gen 1 Type C switch / TAPE + REEL REEL 13" Q1 NDP RoHS Compliant: Yes; Manufacturer: NXP Semiconductors; Supplier 1: Digikey; Manufacturer Part Number: CBTU02043HEJ; RoHS: Yes; Category: USB Interface ICs; Stock 1: 13678; Pricing 1: 1=1.72, 10=1.546, 25=1.458, 100=1.2424, 250=1.16656, 500=1.02074, 1000=0.84575, 2500=0.78742, 5000=0.75826 (USD); RoHS Compliant: Yes; ComponentLink1URL: http://www.farnell.com/datasheets/2615726.pdf?src-supplier=Farnell; ComponentLink1Description: http://www.farnell.com/datasheets/2615726.pdf?src-supplier=Farnell; ComponentLink2URL: http://www.farnell.com/datasheets/2615726.pdf?src-supplier=Newark; ComponentLink2Description: http://www.farnell.com/datasheets/2615726.pdf?src-supplier=Newark; Supplier Part Number 1: 568-13400-6-ND
U12 = IC_CLOCK_PCIE_100MHZ_9FGV0241AKILF: Dual Output 1.8 V Very Low Power PCIE GEN1/2/3 Clock Generator - VFQFPN-24; Manufacturer: Renesas; Max Frequency: 100MHz; Package Equivalence Code: LCC24,.16SQ,20; Frequency: 27MHz; Max Supply Current: 18mA; Max Supply Voltage: 1.9V; Min Supply Voltage: 1.7V; Supply Voltage-Nom: 1.8V; Time @ Peak Reflow Temperature-Max (s): 30s; Interface: SMBus; Qualification Status: Not Qualified; Supplier 1: Digikey; Manufacturer Part Number: 9FGV0241AKILF; RoHS: Yes; Category: Clock and Timing; Stock 1: 451; Pricing 1: 1=3.12, 10=2.338, 25=2.1428, 100=1.9277, 490=1.76506, 980=1.71392, 1470=1.6883, 2940=1.65073, 5390=1.62337 (USD); Mount: Surface Mount; Number of Pins: 24; Package Code: HVQCCN; Package Shape: Square; Terminal Finish: Tin; Min Operating Temperature: -40°C; Max Operating Temperature: 85°C; Moisture Sensitivity Level: 1; JESD-609 Code: e3; JESD-30 Code: S-XQCC-N24; Package Style: CHIP CARRIER, HEAT SINK/SLUG, VERY THIN PROFILEMeter; Peak Reflow Temperature (Cel): 260°C; Surface Mount: Yes; Technology: CMOS; Terminal Form: No Lead; Terminal Position: QUAD; Max Input Voltage: 1.9V; Min Input Voltage: 1.7V; Length: 4mm; Width: 4mm; Height - Seated (Max): 1mm; Terminal Pitch: 0.5mm; RoHS Compliant: Yes; Reach SVHC Compliant: Yes; Temperature Grade: INDUSTRIAL; ComponentLink1URL: https://datasheet.ciiva.com/pdfs/VipMasterIC/IC/RNCC/RNCC-S-A0014527107/RNCC-S-A0014774123-1.pdf?src-supplier=IHS+Markit; ComponentLink1Description: https://datasheet.ciiva.com/pdfs/VipMasterIC/IC/RNCC/RNCC-S-A0014527107/RNCC-S-A0014774123-1.pdf?src-supplier=IHS+Markit; ComponentLink2URL: https://datasheet.octopart.com/9FGV0241AKILF-Renesas-datasheet-16654312.pdf?src-supplier=Future+Electronics; ComponentLink2Description: https://datasheet.octopart.com/9FGV0241AKILF-Renesas-datasheet-16654312.pdf?src-supplier=Future+Electronics; ComponentLink3URL: https://www.idt.com/document/dst/9fgv0241-datasheet?src-supplier=Digikey; ComponentLink3Description: https://www.idt.com/document/dst/9fgv0241-datasheet?src-supplier=Digikey; Supplier Part Number 1: 800-2933-5-ND
U14 = IC_INVERTER_1CH_74LVC1G04GW,125: 74LVC Series 5.5 V Surface Mount Single Inverting Buffer - TSSOP-5; Manufacturer: Nexperia; Max Supply Voltage: 5.5V; Min Supply Voltage: 1.65V; Number of Circuits: 1; Output Current: 32mA; Propagation Delay: 1.6ns; Frequency: 175MHz; Nominal Supply Current: 0A; Supplier 1: Digikey; Manufacturer Part Number: 74LVC1G04GW,125; RoHS: Yes; Category: Logic Gates; Stock 1: 14827; Pricing 1: 1=0.1, 10=0.062, 25=0.0544, 100=0.0455, 250=0.04128, 500=0.03874, 1000=0.03666 (USD); Number of Pins: 5; Min Operating Temperature: -40°C; Max Operating Temperature: 125°C; Logic Function: Inverting; Number of Inputs: 1; Number of Outputs: 1; Height: 1.1mm; RoHS Compliant: Yes; ComponentLink1URL: http://www.farnell.com/datasheets/2185286.pdf?src-supplier=Farnell; ComponentLink1Description: http://www.farnell.com/datasheets/2185286.pdf?src-supplier=Farnell; ComponentLink2URL: https://assets.nexperia.com/documents/data-sheet/74LVC1G04.pdf?src-supplier=Digikey; ComponentLink2Description: https://assets.nexperia.com/documents/data-sheet/74LVC1G04.pdf?src-supplier=Digikey; ComponentLink3URL: https://datasheet.octopart.com/74LVC1G04GW%2C125-Philips-datasheet-5390092.pdf?src-supplier=Future+Electronics; ComponentLink3Description: https://datasheet.octopart.com/74LVC1G04GW%2C125-Philips-datasheet-5390092.pdf?src-supplier=Future+Electronics; ComponentLink4URL: https://datasheet.octopart.com/74LVC1G04GW%2C125-Nexperia-datasheet-12533668.pdf?src-supplier=Element14; ComponentLink4Description: https://datasheet.octopart.com/74LVC1G04GW%2C125-Nexperia-datasheet-12533668.pdf?src-supplier=Element14; Supplier Part Number 1: 1727-2871-1-ND
U15 = IC_GATE_NAND_1CH_74LVC1G38GW,125: IC GATE NAND 1CH 2-INP 5-TSSOP; Manufacturer: Nexperia; Supplier 1: Digikey; Manufacturer Part Number: 74LVC1G38GW,125; RoHS: Yes; Category: Logic Gates; Stock 1: 7830; Pricing 1: 1=0.13, 10=0.09, 25=0.0788, 100=0.0665, 250=0.06064, 500=0.0571, 1000=0.05421, 3000=0.05064, 6000=0.04889, 9000=0.04801, 15000=0.04704, 21000=0.04647, 30000=0.04592, 75000=0.04475, 150000=0.04404 (USD); RoHS Compliant: Yes; ComponentLink1URL: https://datasheet.octopart.com/74LVC1G38GW%2C125-NXP-Semiconductors-datasheet-11767482.pdf?src-supplier=Arrow+Electronics; ComponentLink1Description: https://datasheet.octopart.com/74LVC1G38GW%2C125-NXP-Semiconductors-datasheet-11767482.pdf?src-supplier=Arrow+Electronics; Supplier Part Number 1: 1727-6077-1-ND
U16 = IC_LEVEL_TRANSLATOR_SN74AVC1T45DBVR: 1.2V~3.6V 1 1 1.2V~3.6V 500Mbps SOT-23-6 Translators / Level Shifters ROHS; Manufacturer: Texas Instruments; Number of Channels: 1; Propagation Delay: 5.6ns; Max Supply Voltage: 3.6V; Min Supply Voltage: 1.2V; Logic Function: Transceiver,Inverting,Translator; Turn-On Delay Time: 13.6ns; Low Level Output Current: 12mA; High Level Output Current: -12mA; Quiescent Current: 20uA; Polarity: Non-Inverting; Number of Outputs: 2; Output Type: 3-STATE; Channel Type: Bidirectional; Supplier 1: Digikey; Manufacturer Part Number: SN74AVC1T45DBVR; RoHS: Yes; Category: Voltage Level Shifters; Stock 1: 119354; Pricing 1: 1=0.58, 10=0.408, 25=0.3652, 100=0.3182, 250=0.2958, 500=0.28232, 1000=0.27535 (USD); Mount: Surface Mount; Case/Package: SOT-23; Number of Pins: 6; Weight: 0.000229oz; Min Operating Temperature: -40°C; Max Operating Temperature: 85°C; Data Rate: 500Mbps; Packaging: Tape and Reel; Number of Bits: 1; Number of Elements: 1; Output Current: 12mA; Series: 74AVC; Technology: CMOS; Number of Circuits: 1; Number of Transmitters: 2; Number of Receivers: 2; Number of Inputs: 1; Number of Transceivers: 1; Nominal Supply Current: 20uA; Length: 3.05mm; Width: 1.75mm; Height: 1.45mm; Thickness: 1.2mm; Radiation Hardening: No; Lead Free: Lead Free; RoHS Compliant: Yes; Reach SVHC Compliant: No; ComponentLink1URL: https://datasheet.ciiva.com/15086/getdatasheetpartid-251058-15086540.pdf?src-supplier=Verical; ComponentLink1Description: https://datasheet.ciiva.com/15086/getdatasheetpartid-251058-15086540.pdf?src-supplier=Verical; ComponentLink2URL: https://datasheet.ciiva.com/23785/1635556-23785532.pdf?src-supplier=Newark; ComponentLink2Description: https://datasheet.ciiva.com/23785/1635556-23785532.pdf?src-supplier=Newark; ComponentLink3URL: https://datasheet.ciiva.com/1899/sn74avc1t45-1899272.pdf?src-supplier=Digikey; ComponentLink3Description: https://datasheet.ciiva.com/1899/sn74avc1t45-1899272.pdf?src-supplier=Digikey; ComponentLink4URL: https://datasheet.ciiva.com/1899/sn74avc1t45-1899273.pdf?src-supplier=Digikey; ComponentLink4Description: https://datasheet.ciiva.com/1899/sn74avc1t45-1899273.pdf?src-supplier=Digikey; ComponentLink5URL: https://datasheet.ciiva.com/1899/sn74avc1t45-1899274.pdf?src-supplier=Digikey; ComponentLink5Description: https://datasheet.ciiva.com/1899/sn74avc1t45-1899274.pdf?src-supplier=Digikey; ComponentLink6URL: https://datasheet.ciiva.com/14287/sn74avc1t45-14287319.pdf?src-supplier=Avnet; ComponentLink6Description: https://datasheet.ciiva.com/14287/sn74avc1t45-14287319.pdf?src-supplier=Avnet; ComponentLink7URL: https://datasheet.ciiva.com/1508/1862374-1508649.pdf?src-supplier=Element14; ComponentLink7Description: https://datasheet.ciiva.com/1508/1862374-1508649.pdf?src-supplier=Element14; Supplier Part Number 1: 296-19094-1-ND
Y4 = CRYSTAL_ABRACON_32.768KHZ: OSC XO 32.768KHZ CMOS SMD; Supplier 1: Digi-Key; Manufacturer: Abracon; Manufacturer Part Number: ASH7KW-32.768kHz-L-T; RoHS: Yes; Category: Oscillators; Stock 1: 174; Pricing 1: 1=2.4, 10=2.343, 50=2.231, 100=1.9521, 500=1.89636 (USD); ComponentLink1URL: https://datasheet.ciiva.com/15010/ash7kw-15010563.pdf?src-supplier=Digi-Key; ComponentLink1Description: https://datasheet.ciiva.com/15010/ash7kw-15010563.pdf?src-supplier=Digi-Key; ComponentLink2URL: https://datasheet.ciiva.com/30037/ash7kw-30037881.pdf?src-supplier=Avnet; ComponentLink2Description: https://datasheet.ciiva.com/30037/ash7kw-30037881.pdf?src-supplier=Avnet; ComponentLink3URL: https://datasheet.ciiva.com/15010/ash7kw-15010565.pdf?src-supplier=Digi-Key; ComponentLink3Description: https://datasheet.ciiva.com/15010/ash7kw-15010565.pdf?src-supplier=Digi-Key; Supplier Part Number 1: 535-12059-1-ND
Y5 = CRYSTAL_ECS_25MHZ_ECS-250-18-33-JTM-TR: Crystal 25MHz ±20ppm (Tol) ±20ppm (Stability) 18pF FUND 40Ohm 4-Pin Mini-CSMD T/R; Manufacturer: ECS International; Supplier 1: Digi-Key; Manufacturer Part Number: ECS-250-18-33-JTM-TR; RoHS: Yes; Stock 1: 49724; Pricing 1: 1=0.47, 10=0.39, 50=0.3512, 100=0.3122, 500=0.29654 (USD); ComponentLink1URL: http://www.ecsxtal.com/store/pdf/ecx-32.pdf?src-supplier=Digi-Key; ComponentLink1Description: http://www.ecsxtal.com/store/pdf/ecx-32.pdf?src-supplier=Digi-Key; ComponentLink2URL: https://ecsxtal.com/store/pdf/ecx-32.pdf?src-supplier=Digi-Key; ComponentLink2Description: https://ecsxtal.com/store/pdf/ecx-32.pdf?src-supplier=Digi-Key; ComponentLink3URL: https://datasheet.octopart.com/ECS-250-18-33-JTM-TR-ECS-International-datasheet-17018741.pdf?src-supplier=Electro+Sonic; ComponentLink3Description: https://datasheet.octopart.com/ECS-250-18-33-JTM-TR-ECS-International-datasheet-17018741.pdf?src-supplier=Electro+Sonic; Supplier Part Number 1: XC2964CT-ND